# EAGLE design Ardy-Pro-Outline (EAGLE 6.4)
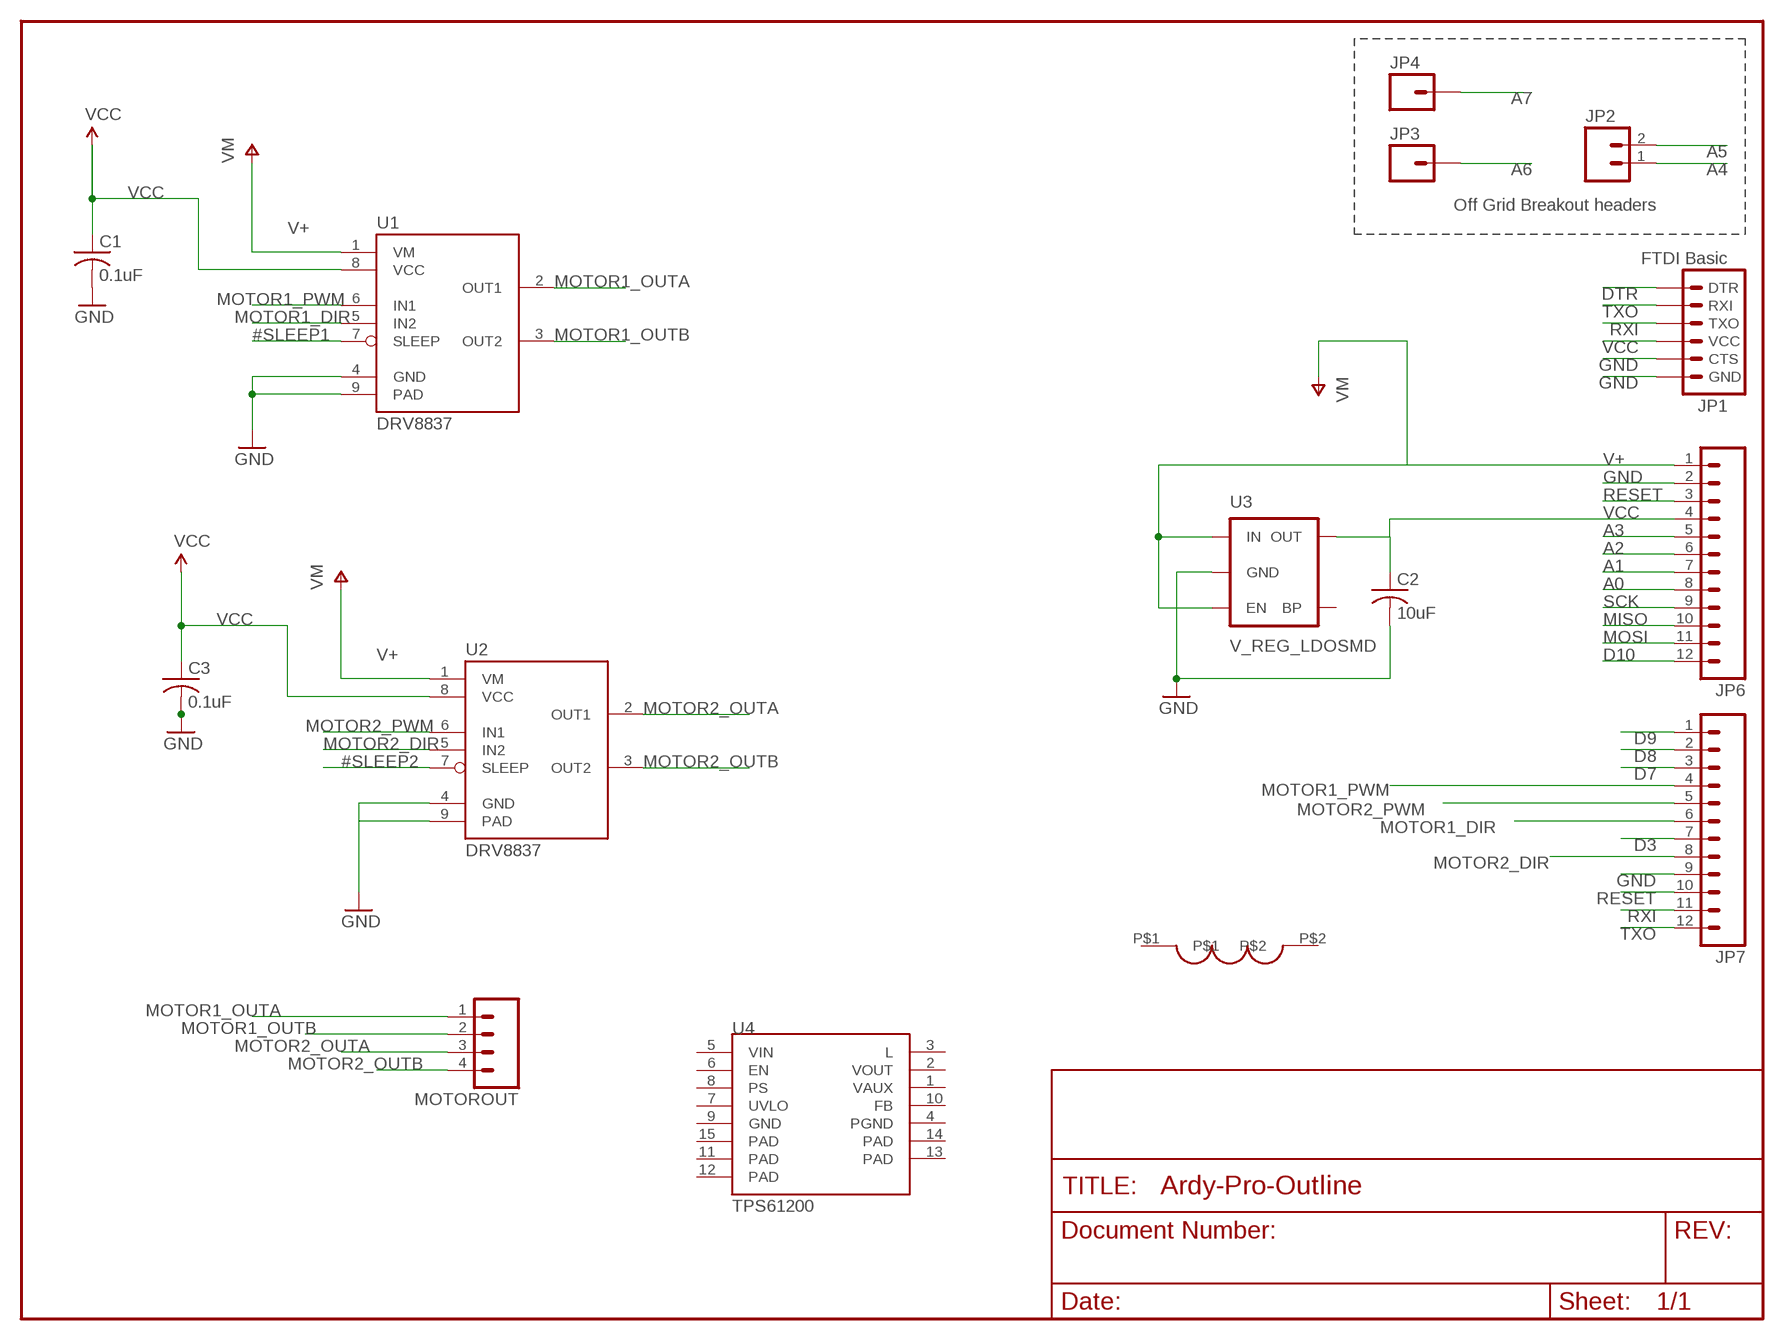
[diagram p0: schematic, sheet 1]

## Parts
2.2UH  2.2uh  2.2UHSMD  [PEBBLE_VLF4012A]
C1  0.1uF  AS-ITM-00008  [C0402]
C2  10uF  AS-ITM-00045  [C0805]
C3  0.1uF  AS-ITM-00008  [C0402]
JP1  FTDI Basic  ARDUINO_SERIAL_PROGRAMPTH  [1X06]
JP2  M02PTH  [1X02]
JP3  M01PTH  [1X01]
JP4  M01PTH  [1X01]
JP6  M12PTH  [1X12]
JP7  M12PTH  [1X12]
MOTOROUT  M04PTH  [1X04]
U1  DRV8837  AS-ITM-00042  [WSON-8]
U2  DRV8837  AS-ITM-00042  [WSON-8]
U3  V_REG_LDOSMD  [SOT23-5]
U4  TPS61200  [QFN-10_PAD]

## Nets
#SLEEP1: U1.7(SLEEP)
#SLEEP2: U2.7(SLEEP)
A0: JP6.8
A1: JP6.7
A2: JP6.6
A3: JP6.5
A4: JP2.1
A5: JP2.2
A6: JP3.1
A7: JP4.1
D3: JP7.7
D7: JP7.3
D8: JP7.2
D9: JP7.1
D10: JP6.12
DTR: JP1.1(DTR)
GND [vcc]: C1.2 C2.2 C3.2 JP1.5(CTS) JP1.6(GND) JP6.2 JP7.9 U1.4(GND) U1.9(PAD) U2.4(GND) U3.2(GND)
MISO: JP6.10
MOSI: JP6.11
MOTOR1_DIR: JP7.6 U1.5(IN2)
MOTOR1_OUTA: MOTOROUT.1 U1.2(OUT1)
MOTOR1_OUTB: MOTOROUT.2 U1.3(OUT2)
MOTOR1_PWM: JP7.4 U1.6(IN1)
MOTOR2_DIR: JP7.8 U2.5(IN2)
MOTOR2_OUTA: MOTOROUT.3 U2.2(OUT1)
MOTOR2_OUTB: MOTOROUT.4 U2.3(OUT2)
MOTOR2_PWM: JP7.5 U2.6(IN1)
N$5: U2.9(PAD)
RESET: JP6.3 JP7.10
RXI: JP1.3(TXO) JP7.11
SCK: JP6.9
TXO: JP1.2(RXI) JP7.12
V+ [vcc]: JP6.1 U1.1(VM) U2.1(VM) U3.1(IN) U3.3(EN) ; supply symbol labelled VM
VCC: C1.1 C2.1 C3.1 JP1.4(VCC) JP6.4 U1.8(VCC) U2.8(VCC) U3.5(OUT)
Unconnected: 2.2UH.P$1 2.2UH.P$2 U3.4(BP) U4.1(VAUX) U4.2(VOUT) U4.3(L) U4.4(PGND) U4.5(VIN) U4.6(EN) U4.7(UVLO) U4.8(PS) U4.9(GND) U4.10(FB) U4.11(PAD) U4.12(PAD) U4.13(PAD) U4.14(PAD) U4.15(PAD)

## Notes on the sheet
- Off Grid Breakout headers

## Library data of the parts
2.2UH = Swarm Mini_Fet_Shield-v.01:2.2UHSMD
C1 C3 = tinycircuits:AS-ITM-00008: CAP CER 0.1UF 16V 10% X5R 0402; PARTNO: AS-ITM-00008
C2 = tinycircuits:AS-ITM-00045: CAP CER 16UF 16V 20% X5R 0805; PARTNO: AS-ITM-00045
JP1 = SparkFun:ARDUINO_SERIAL_PROGRAM
JP2 = SparkFun:M02: Header 2 Standard 2-pin 0.1" header. Use with straight break away headers (SKU : PRT-00116), right angle break away headers (PRT-00553), swiss pins (PRT-00743), machine pins (PRT-00117), and female headers (PRT-00115). Molex polarized connector foot print use with SKU : PRT-08233 with associated crimp pins and housings.
JP3 JP4 = SparkFun:M01: Header 1 Standard 1-pin 0.1" header. Use with straight break away headers (SKU : PRT-00116), right angle break away headers (PRT-00553), swiss pins (PRT-00743), machine pins (PRT-00117), and female headers (PRT-00115).
JP6 JP7 = SparkFun:M12: Header 12 Standard 12-pin 0.1" header. Use with straight break away headers (SKU : PRT-00116), right angle break away headers (PRT-00553), swiss pins (PRT-00743), machine pins (PRT-00117), and female headers (PRT-00115).
MOTOROUT = SparkFun:M04: Header 4 Standard 4-pin 0.1" header. Use with straight break away headers (SKU : PRT-00116), right angle break away headers (PRT-00553), swiss pins (PRT-00743), machine pins (PRT-00117), and female headers (PRT-00115). Molex polarized connector foot print use with SKU : PRT-08231 with associated crimp pins and housings. 1MM SMD Version SKU: PRT-10208
U1 U2 = tinycircuits:AS-ITM-00042: IC PWM MOTR DVR H-BRDG 8WSON; PARTNO: AS-ITM-00042
U3 = SparkFun:V_REG_LDO: Voltage Regulator LDO Standard 150mA LDO voltage regulator in SOT-23 layout. Micrel part MIC5205. BP (by-pass) pin is used to lower output noise with 470pF cap.
U4 = SparkFun:TPS61200: DC to DC Booster

## Net classes
0 default: width 0.203 mm
1 vcc: width 0.254 mm

## Board
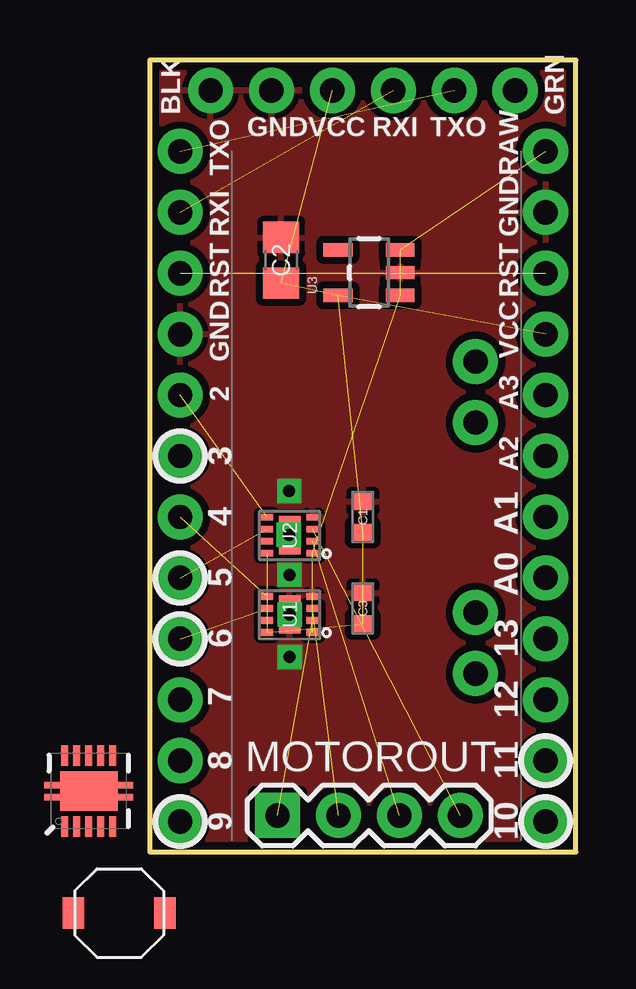
[diagram p1: board, top side]
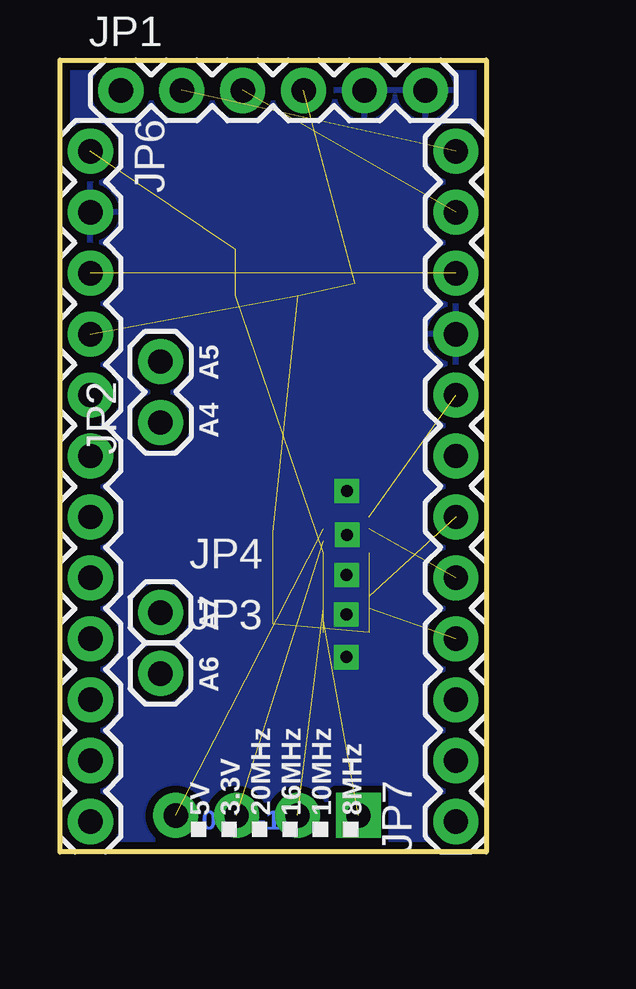
[diagram p2: board, bottom side, seen from below]

Size 17.78 x 33.02 mm. Coordinates in mm from the lower left corner, seen from the top.
Outline: 0,33.02 0,0 17.78,0 17.78,33.02 0,33.02
Copper layers (1*16): Top 0.035mm / dielectric 1.5mm / Bottom 0.035mm
Design rules "default": minimum track width 8mil, minimum drill 20mil, track to track 8mil, track to pad 8mil, pad to pad 8mil, via to via 8mil, smd to smd 8mil, copper to edge 8mil, drill to drill 8mil, minimum pad ring 12mil, minimum via ring 10mil, stop-mask expansion 4mil, vias tented up to drill 20mil, thermal gap 10mil

### Footprints (pad centres in the part's own frame; a part is rotated, then mirrored left to right if it is on the bottom)
PEBBLE_VLF4012A = smd 0.9 x 1.3: P$1 -1.9,0; P$2 1.9,0
C0402 = smd 0.7 x 0.9: 1 -0.65,0; 2 0.65,0
C0805 = smd 1.3 x 1.5: 1 -0.95,0; 2 0.95,0
1X06 = drill 1.016 pad 1.88: 1 0,0; 2 2.54,0; 3 5.08,0; 4 7.62,0; 5 10.16,0; 6 12.7,0
1X02 = drill 1.016 pad 1.88: 1 0,0; 2 2.54,0
1X01 = drill 1.016 pad 1.88: 1 0,0
1X12 = drill 1.016 pad 1.88: 1 0,0; 2 2.54,0; 3 5.08,0; 4 7.62,0; 5 10.16,0; 6 12.7,0; 7 15.24,0; 8 17.78,0; 9 20.32,0; 10 22.86,0; 11 25.4,0; 12 27.94,0
1X04 = drill 1.016 pad 1.88 square: 1 0,0 | drill 1.016 pad 1.88: 2 2.54,0; 3 5.08,0; 4 7.62,0
WSON-8 = smd 0.28 x 0.5: 1 -0.75,-0.95; 2 -0.25,-0.95; 3 0.25,-0.95; 4 0.75,-0.95; 5 0.75,0.95; 6 0.25,0.95; 7 -0.25,0.95; 8 -0.75,0.95 | smd 1.6 x 0.9: 9 0,0
SOT23-5 = smd 0.55 x 1.2: 1 -0.95,-1.3; 2 0,-1.3; 3 0.95,-1.3; 4 0.95,1.3; 5 -0.95,1.3
QFN-10_PAD = smd 0.297 x 0.85: 1 -1,-1.475; 2 -0.5,-1.475; 3 0,-1.475; 4 0.5,-1.475; 5 1,-1.475; 6 1,1.475; 7 0.5,1.475; 8 0,1.475; 9 -0.5,1.475; 10 -1,1.475 | smd 0.7 x 0.28: 11 -1.5,0.25; 12 -1.5,-0.25; 13 1.5,0.25; 14 1.5,-0.25 | smd 2.4 x 1.65: 15 0,0

### Placement (x,y rotation side)
2.2UH  -1.27,-2.54 0 top
C1  8.89,13.97 90 top
C2  5.48,24.67 90 top
C3  8.89,10.16 90 top
JP1  15.24,31.75 0 bottom
JP2  13.59,17.91 90 bottom
JP3  13.59,7.44 0 bottom
JP4  13.59,9.98 0 bottom
JP6  16.51,29.21 270 bottom
JP7  1.27,1.27 90 bottom
MOTOROUT  5.33,1.52 0 top
U1  5.84,9.91 90 top
U2  5.84,13.21 90 top
U3  9.15,24.16 90 top
U4  -2.54,2.54 0 top

### Tracks (layer width: path | path; a pad name or v marks a point on that pad's centre or on a via)
GND  (via drill 0.5)
  other vias: 5.84,9.91 5.84,8.13 5.82,11.55 5.8,13.22 5.82,15.05
  pour Top (isolate 0.305): 0,33.02 17.78,33.02 17.78,0 0,0
  pour Bottom (isolate 0.305): 0,33.02 17.78,33.02 17.78,0 0,0
MOTOR1_DIR  (1 unrouted)
MOTOR1_OUTA  (1 unrouted)
MOTOR1_OUTB  (1 unrouted)
MOTOR1_PWM  (1 unrouted)
MOTOR2_DIR  (1 unrouted)
MOTOR2_OUTA  (1 unrouted)
MOTOR2_OUTB  (1 unrouted)
MOTOR2_PWM  (1 unrouted)
RESET  (1 unrouted)
RXI  (1 unrouted)
TXO  (1 unrouted)
V+  (4 unrouted)
VCC  (7 unrouted)

### Text on the board
Bottom: 10-12-11
tPlace: BLK | GRN | GND | VCC | RXI | TXO | TXO | RAW | RXI | GND | RST | RST | VCC | GND | 2 | A3 | 3 | A2 | 4 | A1 | 5 | A0 | 6 | 13 | 7 | 12 | 8 | 11 | 9 | 10
bPlace: A5 | A4 | A7 | A6 | 8MHz | 10MHz | 16MHz | 20MHz | 3.3V | 5V